# EasyEDA Pro project GEEKS_DEVELOPMENT_BOARD_STM32F4.eprj, schematic Schematic2
Create Date: 2024-10-02; Page Name: P1; Project Name: GEEKS_DEVELOPMENT_BOARD_STM32F4; Schematic Name: Schematic2; Update Date: 2024-10-02; Company: 嘉立创EDA; Page Size: A4; Version: V1.0
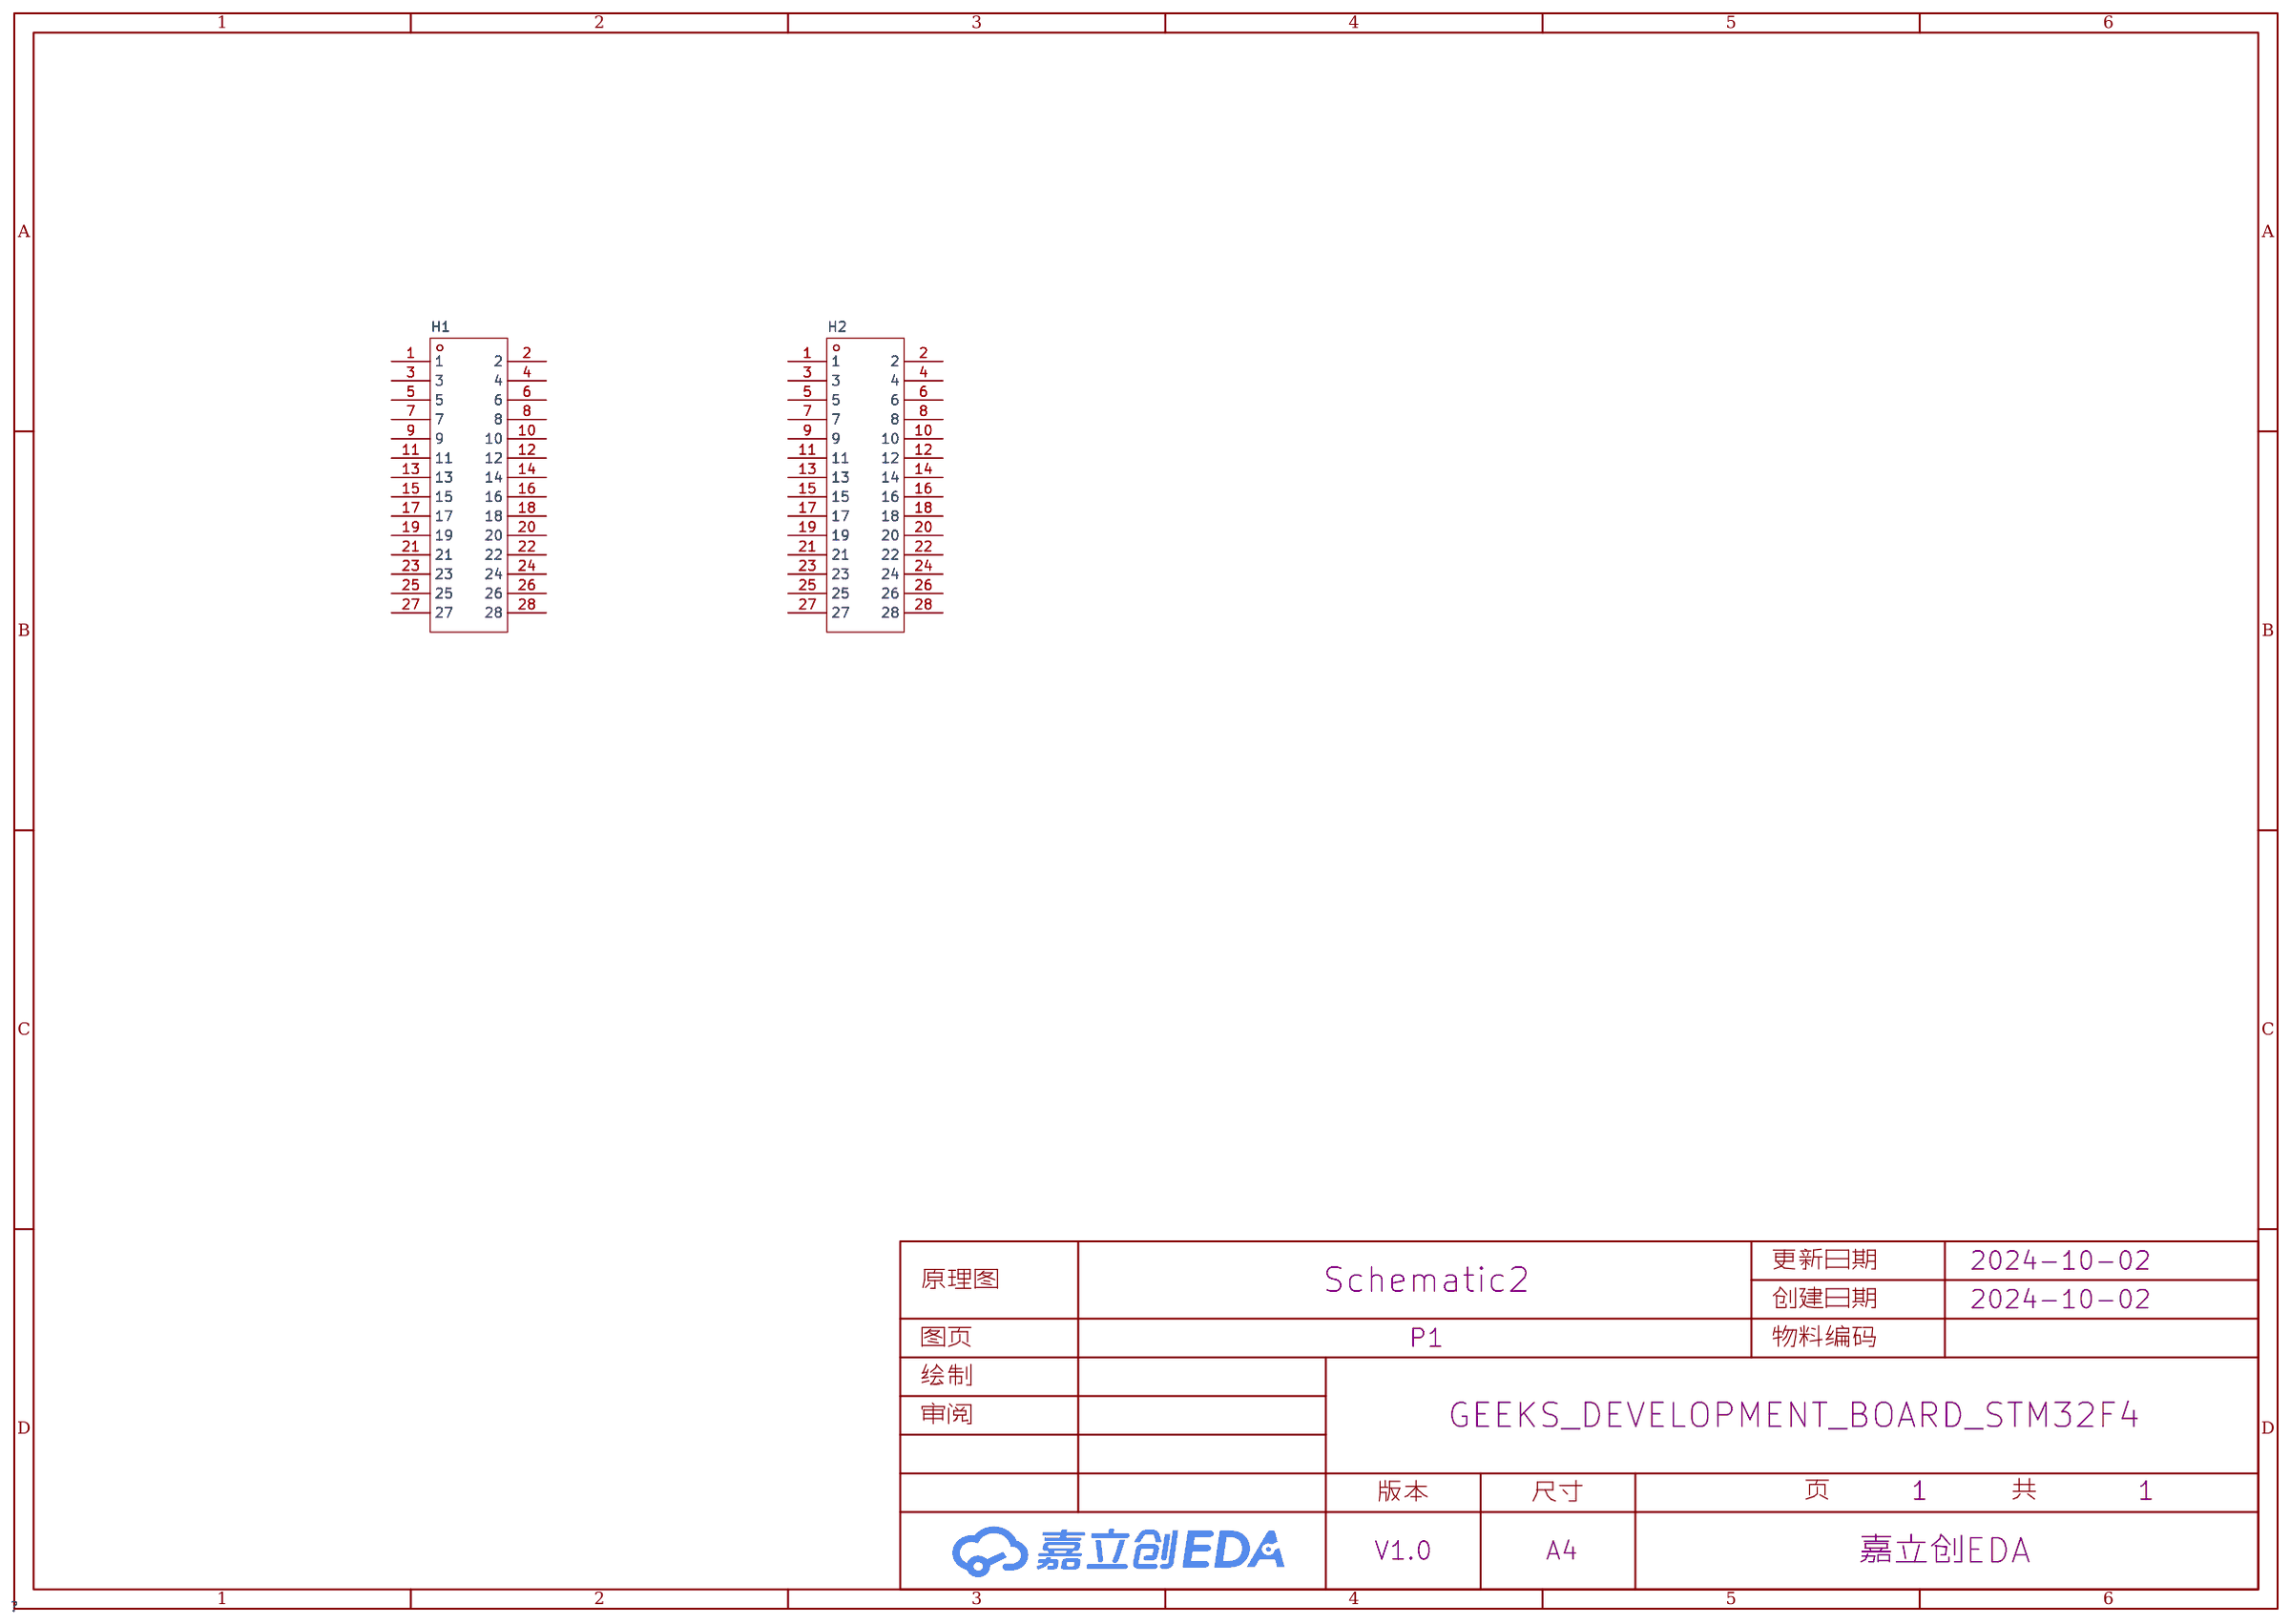
[diagram p1: schematic sheet]

## Parts
H1  -  [HDR-TH_28P-P2.54-V-F-R2-C14-S2.54-1]
H2  -  [HDR-TH_28P-P2.54-V-F-R2-C14-S2.54-1]

## Library data of the parts
H1 H2 = HDR-M_2.54_2x14: Supplier Part: C132128; Supplier Footprint: 插件; JLCPCB Part Class: 扩展库

## Nets

Not connected (* = marked no-connect by the designer): H1 1 2 3 4 5 6 7 8 9 10 11 12 13 14 15 16 17 18 19 20 21 22 23 24 25 26 27 28; H2 1 2 3 4 5 6 7 8 9 10 11 12 13 14 15 16 17 18 19 20 21 22 23 24 25 26 27 28
